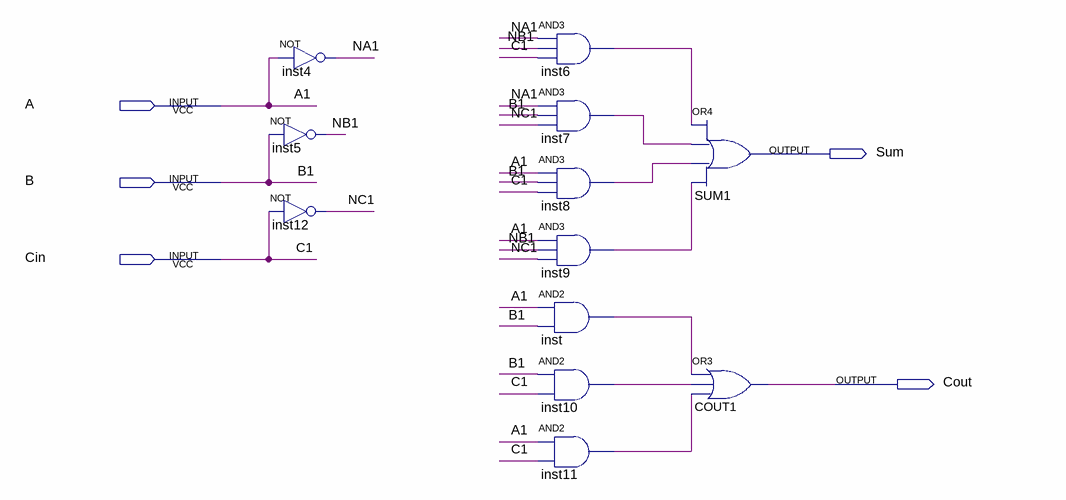
[diagram p0: schematic sheet]
// Quartus schematic Bit1Adder.bdf as structural Verilog: 12 symbols, 5 pins
module Bit1Adder (
  input  A,
  input  B,
  input  Cin,
  output Sum,
  output Cout
);

  wire inst6_out, inst7_out, inst8_out, inst9_out, inst10_out, inst11_out, inst_out, NA1, NB1, NC1;

  not inst4 (NA1, A);
  not inst5 (NB1, B);
  not inst12 (NC1, Cin);
  and inst6 (inst6_out, NA1, NB1, Cin);
  and inst7 (inst7_out, NA1, B, NC1);
  and inst8 (inst8_out, A, B, Cin);
  and inst9 (inst9_out, A, NB1, NC1);
  and inst (inst_out, A, B);
  and inst10 (inst10_out, B, Cin);
  and inst11 (inst11_out, A, Cin);
  or SUM1 (Sum, inst6_out, inst7_out, inst8_out, inst9_out);
  or COUT1 (Cout, inst_out, inst10_out, inst11_out);

  // Other names for the same wires on the sheet: A1 = A; B1 = B; C1 = Cin
endmodule
